# EAGLE design rom-programmer (EAGLE 9.6.1)
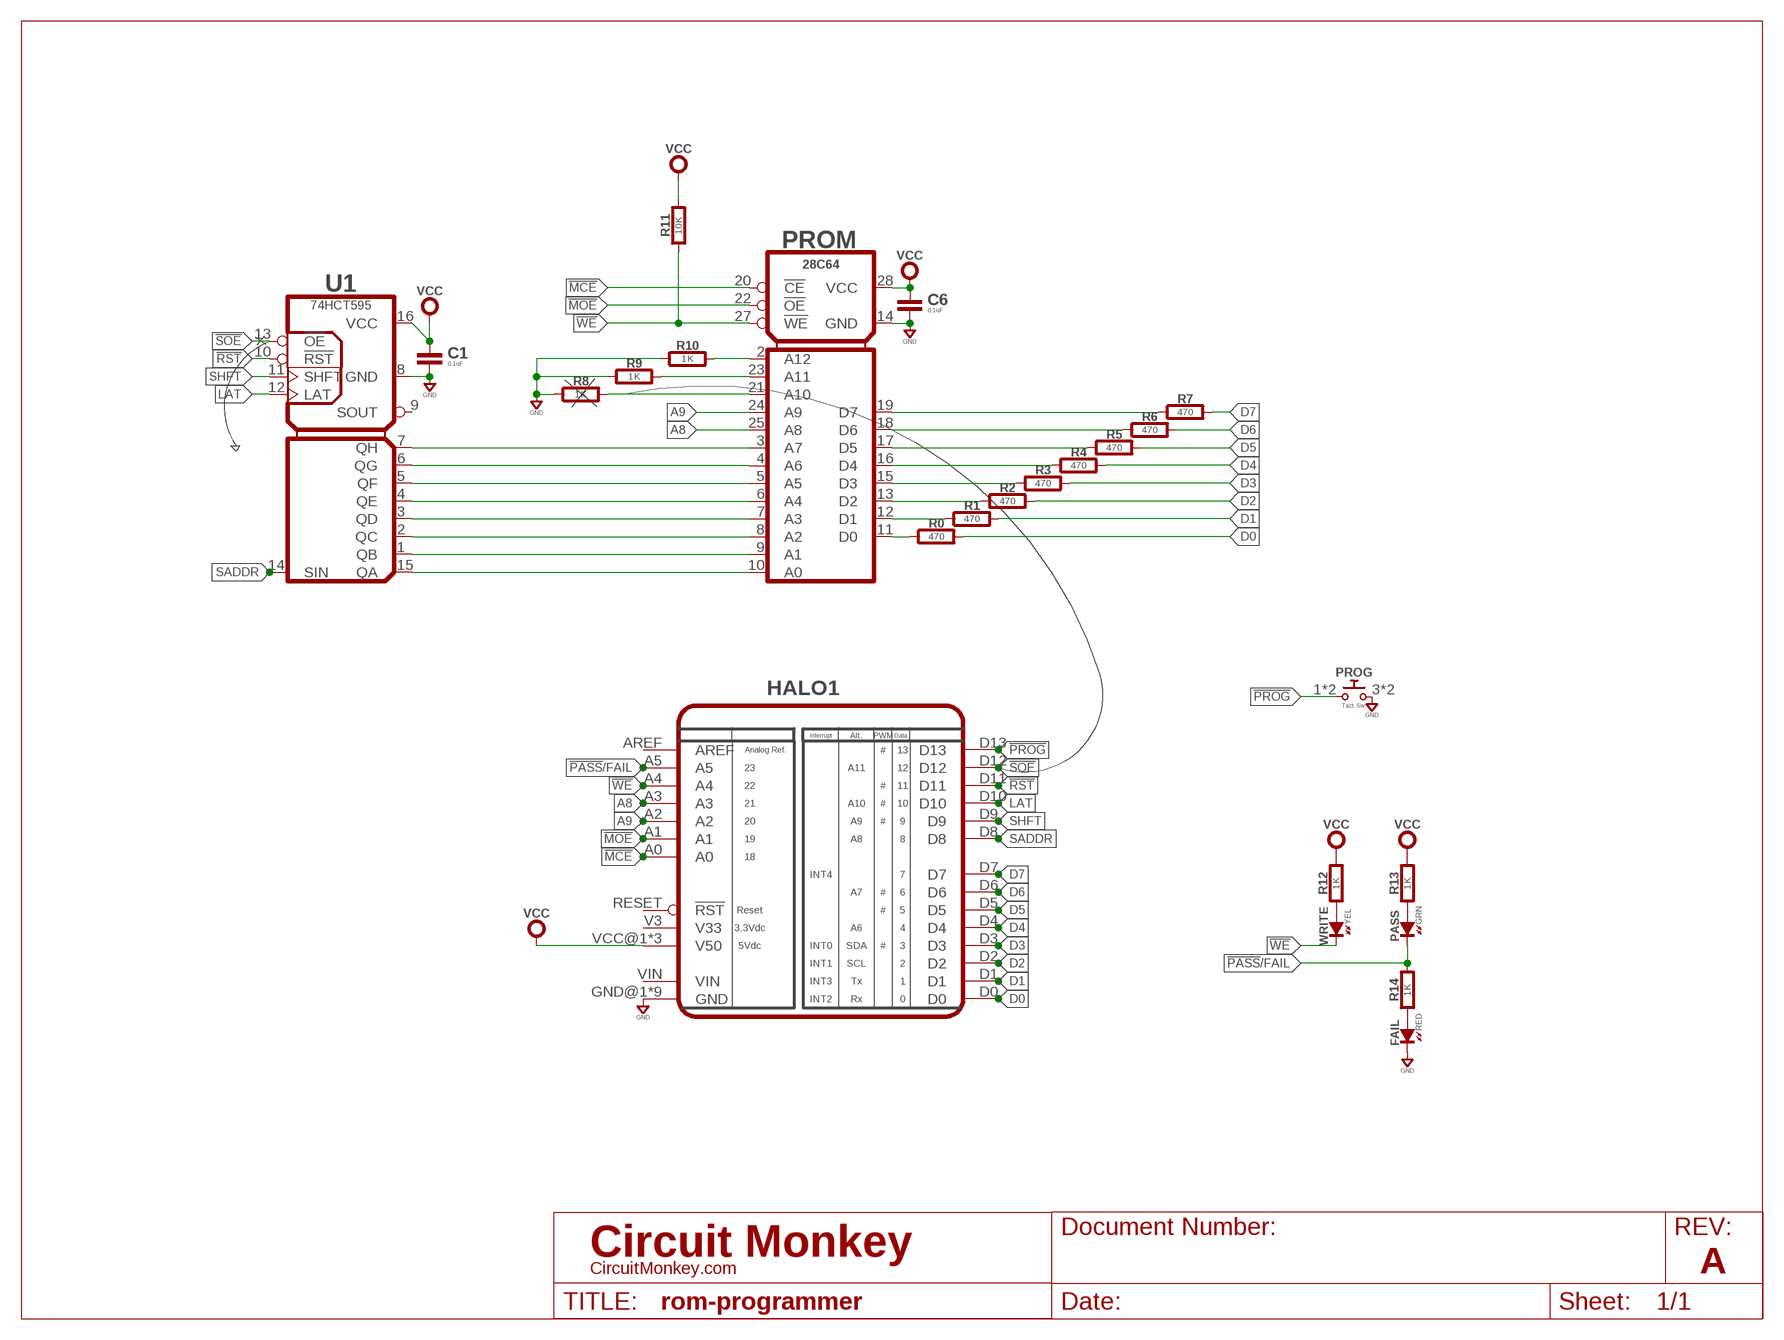
[diagram p0: schematic, sheet 1]
U$1 (LETTER_L-CIRCUITMONKEY): REV: A

## Parts
C1  0.1uF  CAPACITOR0603  [0603-CAP]
C6  0.1uF  CAPACITOR0603  [0603-CAP]
FAIL  RED  SMT0603  [SMD_0603]
HALO1  HALO-A2  [PCB-HALO-A2-PINS]
PASS  GRN  SMT0603  [SMD_0603]
PROG  Tact. Sw.  PUSHBTN-MOMB3FS  [B3FS]
PROM  28C64  28C64S  [SO28]
R0  470  RESISTOR0603  [0603-RES]
R1  470  RESISTOR0603  [0603-RES]
R2  470  RESISTOR0603  [0603-RES]
R3  470  RESISTOR0603  [0603-RES]
R4  470  RESISTOR0603  [0603-RES]
R5  470  RESISTOR0603  [0603-RES]
R6  470  RESISTOR0603  [0603-RES]
R7  470  RESISTOR0603  [0603-RES]
R8  1K  RESISTOR0603  [0603-RES]
R9  1K  RESISTOR0603  [0603-RES]
R10  1K  RESISTOR0603  [0603-RES]
R11  10K  RESISTOR0603  [0603-RES]
R12  1K  RESISTOR0603  [0603-RES]
R13  1K  RESISTOR0603  [0603-RES]
R14  1K  RESISTOR0603  [0603-RES]
U1  74HCT595  74HCT595ADG  [SO16]
WRITE  YEL  SMT0603  [SMD_0603]

## Nets
!MCE: HALO1.A0 PROM.20(!CE)
!MOE: HALO1.A1 PROM.22(!OE)
!PASS!/FAIL: HALO1.A5 PASS.K(C) R14.2
!PROG: HALO1.D13 PROG.1 PROG.2
!RST: HALO1.D11 U1.10(!RST)
!SOE: HALO1.D12 U1.13(!OE)
!WE: HALO1.A4 PROM.27(!WE) R11.1 WRITE.K(C)
A0: PROM.10(A0) U1.15(QA)
A1: PROM.9(A1) U1.1(QB)
A2: PROM.8(A2) U1.2(QC)
A3: PROM.7(A3) U1.3(QD)
A4: PROM.6(A4) U1.4(QE)
A5: PROM.5(A5) U1.5(QF)
A6: PROM.4(A6) U1.6(QG)
A7: PROM.3(A7) U1.7(QH)
A8: HALO1.A3 PROM.25(A8)
A9: HALO1.A2 PROM.24(A9)
D0: HALO1.D0 R0.2
D1: HALO1.D1 R1.2
D2: HALO1.D2 R2.2
D3: HALO1.D3 R3.2
D4: HALO1.D4 R4.2
D5: HALO1.D5 R5.2
D6: HALO1.D6 R6.2
D7: HALO1.D7 R7.2
GND: C1.2 C6.2 FAIL.K(C) HALO1.GND@1(GND) HALO1.GND@1.2(GND) HALO1.GND@2(GND) HALO1.GND@3(GND) HALO1.GND@4(GND) HALO1.MTG1(GND) HALO1.MTG2(GND) HALO1.MTG3(GND) HALO1.MTG4(GND) PROG.3 PROG.4 PROM.14(GND) R8.1 R9.1 R10.1 U1.8(GND)
LAT: HALO1.D10 U1.12(LAT)
N$1: FAIL.A R14.1
N$2: PROM.21(A10) R8.2
N$3: PROM.23(A11) R9.2
N$4: PROM.2(A12) R10.2
N$5: PASS.A R13.1
N$6: R12.1 WRITE.A
N$27: PROM.11(D0) R0.1
N$28: PROM.12(D1) R1.1
N$29: PROM.13(D2) R2.1
N$30: PROM.15(D3) R3.1
N$31: PROM.16(D4) R4.1
N$32: PROM.17(D5) R5.1
N$33: PROM.18(D6) R6.1
N$34: PROM.19(D7) R7.1
SADDR: HALO1.D8 U1.14(SIN)
SHFT: HALO1.D9 U1.11(SHFT)
VCC: C1.1 C6.1 HALO1.VCC@1(V50) HALO1.VCC@2(V50) HALO1.VCC@3(V50) PROM.28(VCC) R11.2 R12.2 R13.2 U1.16(VCC)
Unconnected: HALO1.AREF HALO1.RESET(!RST) HALO1.V3(V33) HALO1.VIN U1.9(SOUT)

## Library data of the parts
C1 C6 = rlc:CAPACITOR: Capacitor CAP
FAIL PASS WRITE = led:SMT: LED SMT
HALO1 = solstice-design-system:HALO: Halo PCB and symbol, ready to hook up.
PROG = switch-smd:PUSHBTN-MOM: Pushbutton Switch; MFR: Omron; MPN: B3FS-10*
PROM = logic:28*64?: EEPROM 8K x 8; MFR: Microchip; MPN: AT28C64B-15SU
R0 R1-R14 = rlc:RESISTOR: Resistor
U1 = logic:74*595AD?: Shift Register, 8-bit, SIPO; MFR: ON Semi; MPN: 74HCT595ADG

## Board
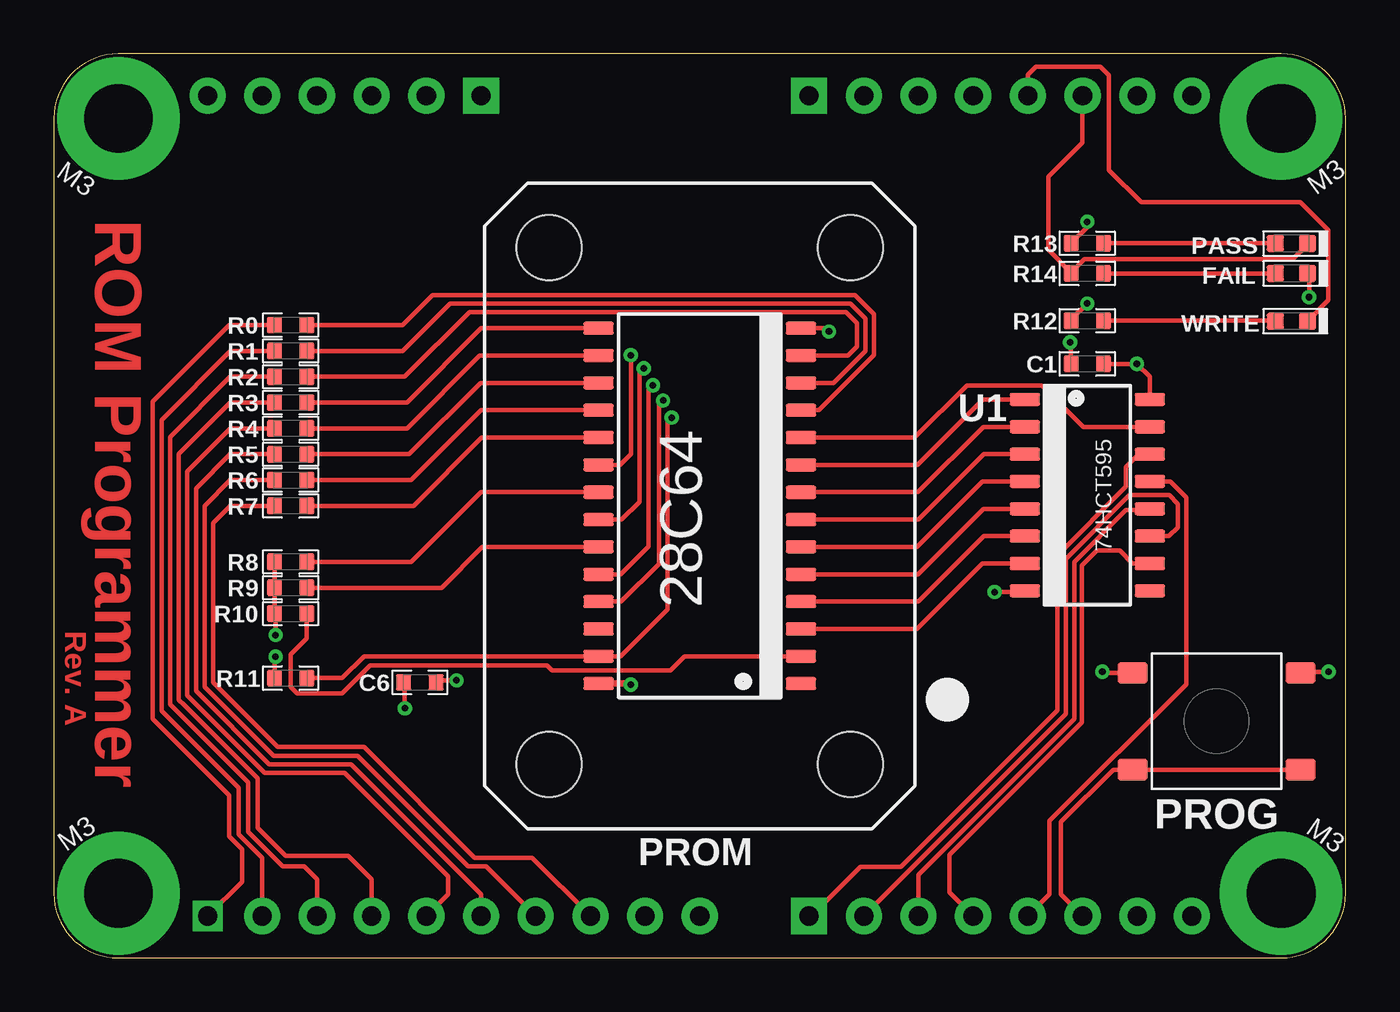
[diagram p1: board, top side]
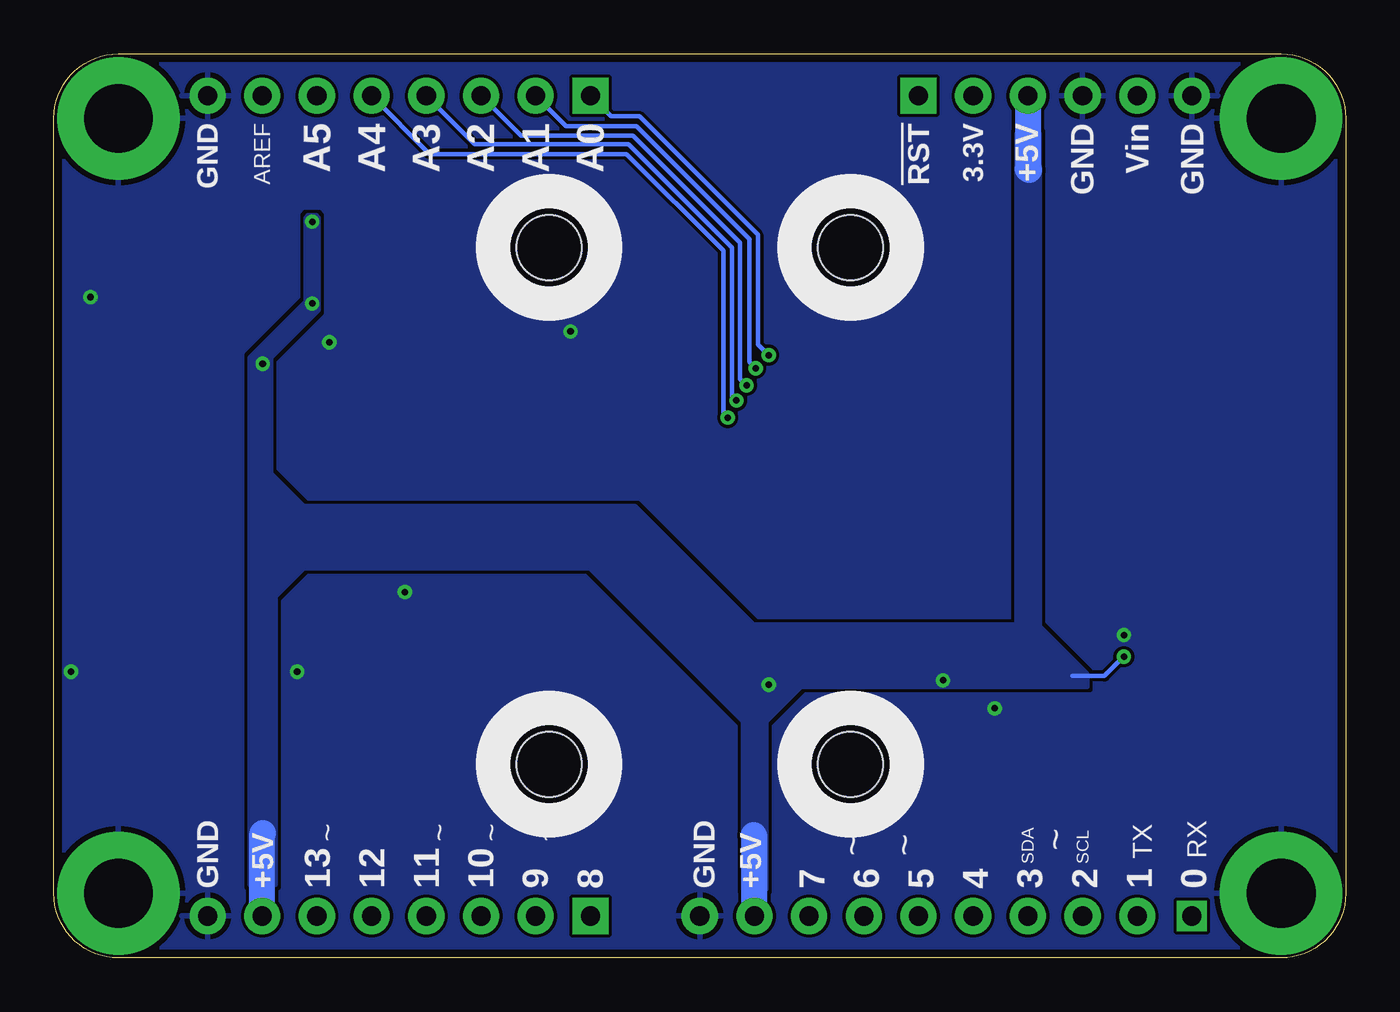
[diagram p2: board, bottom side, seen from below]

Size 60 x 42 mm. Coordinates in mm from the lower left corner, seen from the top.
Copper layers (1*16): Top 0.0356mm / dielectric 1.5011mm / Bottom 0.0356mm
Design rules "OSH-CircuitMonkey *": minimum track width 6mil, minimum drill 12mil, track to track 6mil, track to pad 6mil, pad to pad 6mil, via to via 6mil, smd to smd 6mil, copper to edge 15mil, drill to drill 6mil, minimum pad ring 7mil, minimum via ring 7mil, stop-mask expansion 3mil, vias tented up to drill 13mil, thermal gap 10mil
Holes 3 mm at 23,33 37,33 23,9 37,9

### Footprints (pad centres in the part's own frame; a part is rotated, then mirrored left to right if it is on the bottom)
0603-CAP = smd 0.711 x 0.762: 1 -0.752,0; 2 0.752,0
SMD_0603 = smd 0.8 x 0.8: A 0.75,0; K -0.75,0
PCB-HALO-A2-PINS = drill 0.889 pad 1.676 square: A0 5.08,19.05; D8 5.08,-19.05; RESET -10.16,19.05 | drill 0.889 pad 1.676: A1 7.62,19.05; A2 10.16,19.05; A3 12.7,19.05; A4 15.24,19.05; A5 17.78,19.05; AREF 20.32,19.05; D1 -20.32,-19.05; D2 -17.78,-19.05; D3 -15.24,-19.05; D4 -12.7,-19.05; D5 -10.16,-19.05; D6 -7.62,-19.05; D7 -5.08,-19.05; D9 7.62,-19.05; D10 10.16,-19.05; D11 12.7,-19.05; D12 15.24,-19.05; D13 17.78,-19.05; GND@1 -22.86,19.05; GND@1.2 -17.78,19.05; GND@2 0,-19.05; GND@3 22.86,-19.05; GND@4 22.86,19.05; V3 -12.7,19.05; VCC@1 -15.24,19.05; VCC@2 -2.54,-19.05; VCC@3 20.32,-19.05; VIN -20.32,19.05 | drill 0.889 pad 1.397 square: D0 -22.86,-19.05 | drill 3.2 pad 5.7: MTG1 -27,-18; MTG2 -27,18; MTG3 27,18; MTG4 27,-18
B3FS = smd 1.4 x 1: 1 3.9,-2.25; 2 -3.9,-2.25; 3 3.9,2.25; 4 -3.9,2.25
SO28 = smd 0.6 x 1.4: 1 -8.255,-4.7; 2 -6.985,-4.7; 3 -5.715,-4.7; 4 -4.445,-4.7; 5 -3.175,-4.7; 6 -1.905,-4.7; 7 -0.635,-4.7; 8 0.635,-4.7; 9 1.905,-4.7; 10 3.175,-4.7; 11 4.445,-4.7; 12 5.715,-4.7; 13 6.985,-4.7; 14 8.255,-4.7; 15 8.255,4.7; 16 6.985,4.7; 17 5.715,4.7; 18 4.445,4.7; 19 3.175,4.7; 20 1.905,4.7; 21 0.635,4.7; 22 -0.635,4.7; 23 -1.905,4.7; 24 -3.175,4.7; 25 -4.445,4.7; 26 -5.715,4.7; 27 -6.985,4.7; 28 -8.255,4.7
0603-RES = smd 0.711 x 0.762: 1 -0.752,0; 2 0.752,0
SO16 = smd 0.6 x 1.4: 1 -4.445,-2.9; 2 -3.175,-2.9; 3 -1.905,-2.9; 4 -0.635,-2.9; 5 0.635,-2.9; 6 1.905,-2.9; 7 3.175,-2.9; 8 4.445,-2.9; 9 4.445,2.9; 10 3.175,2.9; 11 1.905,2.9; 12 0.635,2.9; 13 -0.635,2.9; 14 -1.905,2.9; 15 -3.175,2.9; 16 -4.445,2.9

### Placement (x,y rotation side)
C1  48,27.6 180 top
C6  17,12.8 180 top
FAIL  57.48,31.8 180 top
HALO1  30,21 0 top
PASS  57.48,33.19 180 top
PROG  54,11 0 top
PROM  30,21 90 top
R0  11,29.4 180 top
R1  11,28.2 180 top
R2  11,27 180 top
R3  11,25.8 180 top
R4  11,24.6 180 top
R5  11,23.4 180 top
R6  11,22.2 180 top
R7  11,21 180 top
R8  11,18.4 0 top
R9  11,17.2 0 top
R10  11,16 0 top
R11  11,13 180 top
R12  48,29.6 180 top
R13  48,33.2 180 top
R14  48,31.8 180 top
U1  48,21.5 270 top
WRITE  57.48,29.58 180 top

### Tracks (layer width: path | path; a pad name or v marks a point on that pad's centre or on a via)
!MCE  (via drill 0.3)
  Top 0.2: v26.8,28 26.8,23.4 26.3,22.91 PROM.20
  Bottom 0.2: v26.8,28 27.3,28.5 27.3,33.6 32.8,39.1 34.13,39.1 HALO1.A0
!MOE  (via drill 0.3)
  Top 0.2: PROM.22 26.38,20.36 27.2,21.19 27.2,27.19 v27.4,27.39
  Bottom 0.2: v27.4,27.39 27.7,27.68 27.7,33.4 32.95,38.65 36.22,38.65 HALO1.A1
!PASS!/FAIL
  Top 0.2: PASS.K 58.23,33.13 57.55,32.45 47.85,32.45 47.25,31.85 | R14.2 47.25,31.85 | HALO1.A5 47.78,37.88 46.2,36.3 46.2,32.9 47.25,31.85
!PROG
  Top 0.2: HALO1.D13 46.78,2.95 46.78,6.33 49.2,8.75 PROG.2 PROG.1
!RST
  Top 0.2: U1.10 50.1,18.32 49.5,18.93 48.45,18.93 47.75,18.23 47.75,10.95 41.6,4.8 41.6,3.05 HALO1.D11
!SOE
  Top 0.2: HALO1.D12 46.24,2.95 46.24,6.36 52.6,12.72 52.6,21.4 51.87,22.14 U1.13
!WE  (via drill 0.3)
  Top 0.2: v28.7,25.1 28.5,25.1 28.5,16.2 26.32,14.02 PROM.27 14.41,14.02 13.4,13 R11.1 | HALO1.A4 45.24,41.04 45.6,41.4 48.6,41.4 49,41 49,36.6 50.5,35.1 57.9,35.1 59.2,33.8 59.2,30.55 WRITE.K
  Bottom 0.2: v28.7,25.1 28.9,25.3 28.9,32.85 33.4,37.35 42.54,37.35 HALO1.A4
A0
  Top 0.2: PROM.10 39.98,24.18 42.4,26.6 45.9,26.6 47.83,24.68 U1.15
A1
  Top 0.2: PROM.9 40.1,22.91 43.15,25.95 U1.1
A2
  Top 0.2: PROM.8 40.13,21.64 43.17,24.68 U1.2
A3
  Top 0.2: PROM.7 40.16,20.36 43.2,23.41 U1.3
A4
  Top 0.2: PROM.6 40.09,19.09 43.13,22.14 U1.4
A5
  Top 0.2: PROM.5 40.12,17.82 43.16,20.86 U1.5
A6
  Top 0.2: PROM.4 40.16,16.55 43.2,19.59 U1.6
A7
  Top 0.2: PROM.3 40.09,15.29 43.12,18.32 U1.7
A8  (via drill 0.3)
  Top 0.2: PROM.25 26.36,16.55 28.1,18.3 28.1,25.7 v28.3,25.9
  Bottom 0.2: v28.3,25.9 28.5,26.1 28.5,33 33.3,37.8 40.45,37.8 HALO1.A3
A9  (via drill 0.3)
  Top 0.2: PROM.24 26.32,17.82 27.63,19.13 27.63,26.4 v27.83,26.6
  Bottom 0.2: v27.83,26.6 28.13,26.9 28.13,33.23 33.1,38.2 38.31,38.2 HALO1.A2
D0
  Top 0.2: HALO1.D0 8.74,3.55 8.74,5.05 8.14,5.65 8.14,7.56 4.6,11.1 4.6,25.85 8.15,29.4 R0.2
D1
  Top 0.2: HALO1.D1 9.68,4.65 8.58,5.75 8.58,7.89 5,11.47 5,25 8.2,28.2 R1.2
D2
  Top 0.2: HALO1.D2 12.22,3.65 11.62,4.25 10.62,4.25 9.02,5.85 9.02,8.15 5.4,11.77 5.4,24.2 8.2,27 R2.2
D3
  Top 0.2: R3.2 8.2,25.8 5.8,23.4 5.8,12 6.05,11.75 9.46,8.34 9.46,6.05 10.76,4.75 13.66,4.75 14.76,3.65 HALO1.D3
D4
  Top 0.2: R4.2 8.2,24.6 6.2,22.6 6.2,12.2 9.8,8.6 13.5,8.6 18.3,3.8 18.3,2.95 HALO1.D4
D5
  Top 0.2: R5.2 8.2,23.4 6.6,21.8 6.6,12.4 10,9 13.8,9 19.84,2.96 HALO1.D5
D6
  Top 0.2: R6.2 8.2,22.2 7,21 7,12.6 10.2,9.4 14.1,9.4 19.25,4.25 20.08,4.25 HALO1.D6
D7
  Top 0.2: R7.2 8.2,21 7.4,20.2 7.4,12.8 10.4,9.8 14.4,9.8 19.55,4.65 22.22,4.65 HALO1.D7
GND  (via drill 0.3)
  Top 0.2: U1.8 45.05,17 v43.7,17 | v36,29.1 35.84,29.25 PROM.14 | PROG.4 48.75,13.25 v48.7,13.3 | PROG.3 57.95,13.3 v59.2,13.3 | FAIL.K 58.3,31.73 v58.3,30.7 | C1.2 47.25,28.55 v47.2,28.6 | C6.2 16.3,12.75 v16.3,11.6 | v10.3,15 10.3,15.95 R10.1 R9.1 R8.1
  pour Bottom (rank 5): 0,0 0,42 60,42 60,0
LAT
  Top 0.2: U1.12 50.84,20.8 49.8,20.8 47.4,18.4 47.4,11.1 40.16,3.86 HALO1.D10
N$1
  Top 0.2: R14.1 FAIL.A
N$2
  Top 0.2: R8.2 16.6,18.4 19.84,21.64 PROM.21
N$3
  Top 0.2: R9.2 18,17.2 19.89,19.09 PROM.23
N$4
  Top 0.2: R10.2 11.75,14.85 11,14.1 11,12.6 11.3,12.3 13.4,12.3 14.7,13.6 22.91,13.6 23.15,13.36 28.65,13.36 29.3,14.02 PROM.2
N$5
  Top 0.2: PASS.A R13.1
N$6
  Top 0.2: R12.1 56.71,29.6 WRITE.A
N$27
  Top 0.2: R0.1 16.2,29.4 17.6,30.8 37.2,30.8 38.1,29.9 38.1,28 35.55,25.45 PROM.11
N$28
  Top 0.2: R1.1 16.2,28.2 18.4,30.4 37,30.4 37.7,29.7 37.7,28.2 36.22,26.71 PROM.12
N$29
  Top 0.2: R2.1 16.3,27 19.3,30 36.8,30 37.3,29.5 37.3,28.4 36.88,27.98 PROM.13
N$30
  Top 0.2: R3.1 16.4,25.8 19.86,29.25 PROM.15
N$31
  Top 0.2: R4.1 16.4,24.6 19.79,27.98 PROM.16
N$32
  Top 0.2: R5.1 16.5,23.4 19.82,26.71 PROM.17
N$33
  Top 0.2: R6.1 16.6,22.2 19.84,25.45 PROM.18
N$34
  Top 0.2: R7.1 16.7,21 19.88,24.18 PROM.19
SADDR
  Top 0.2: U1.14 50.4,23.41 49.8,22.8 49.8,21.91 46.6,18.7 46.6,11.5 39.34,4.24 37.47,4.24 35.18,1.95 HALO1.D8
SHFT
  Top 0.2: HALO1.D9 47,11.33 47,18.54 49.96,21.5 51.8,21.5 52.2,21.1 52.2,20 51.8,19.59 U1.11
VCC  (via drill 0.3)
  Top 0.2: U1.16 50.9,27 v50.3,27.6 C1.1 | R12.2 47.25,29.65 v48,30.4 | R13.2 48,33.95 v48,34.2 | R11.2 10.25,13.95 v10.3,14 | C6.1 17.85,12.9 v18.7,12.9
  Top 0.305: PROM.28 26.75,12.74 v26.8,12.7
  Bottom 0.2: v10.3,14 11.2,13.1 12.7,13.1
  Bottom 1.2: HALO1.VCC@1 14.76,36.66 14.7,36.6 | HALO1.VCC@2 27.46,5.66 27.5,5.7 | HALO1.VCC@3 50.32,5.78 50.3,5.8
  pour Bottom: 14.2,38.3 14.2,15.4 12,13.2 12,12.6 25.3,12.6 26.9,11 26.9,3.2 28,3.2 28,11 35.1,18.1 48.4,18.1 49.7,16.8 49.7,3.4 50.9,3.4 50.9,27.9 48.3,30.5 48.3,34.4 48.2,34.5 47.8,34.5 47.7,34.4 47.7,30.1 49.9,27.9 49.9,22.5 48.4,21 33,21 27.5,15.5 15.3,15.5 15.3,38.3

### Text on the board
Top: ROM Programmer | Rev. A